# Altium schematic sheet SpaceLabUFSC_SchematicTemplate_A4_Landscape.SchDoc
size A4; Organization: SpaceLab UFSC; Address1: UFSC - SpaceLab; Address2: University Campus - Trindade; Address3: Dep. of Electrical Engineering - CTC; Address4: Florianópolis, Santa Catarina, Brazil; Address5: CEP: 88040 - 900
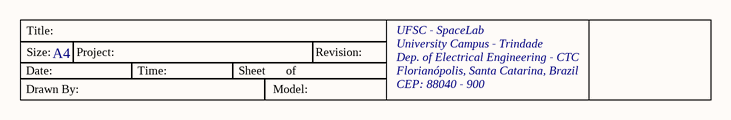
[diagram p0: SpaceLabUFSC_SchematicTemplate_A4_Landscape.SchDoc]

## Notes on the sheet
- Date:
- Title:
- Size:
- A4
- Project:
- Time:
- Sheet
- of
- Revision:
- UFSC - SpaceLab
- University Campus - Trindade
- Dep. of Electrical Engineering - CTC
- Florianópolis, Santa Catarina, Brazil
- CEP: 88040 - 900
- Drawn By:
- Model: